# EAGLE design hermes-control (EAGLE 9.4.0)
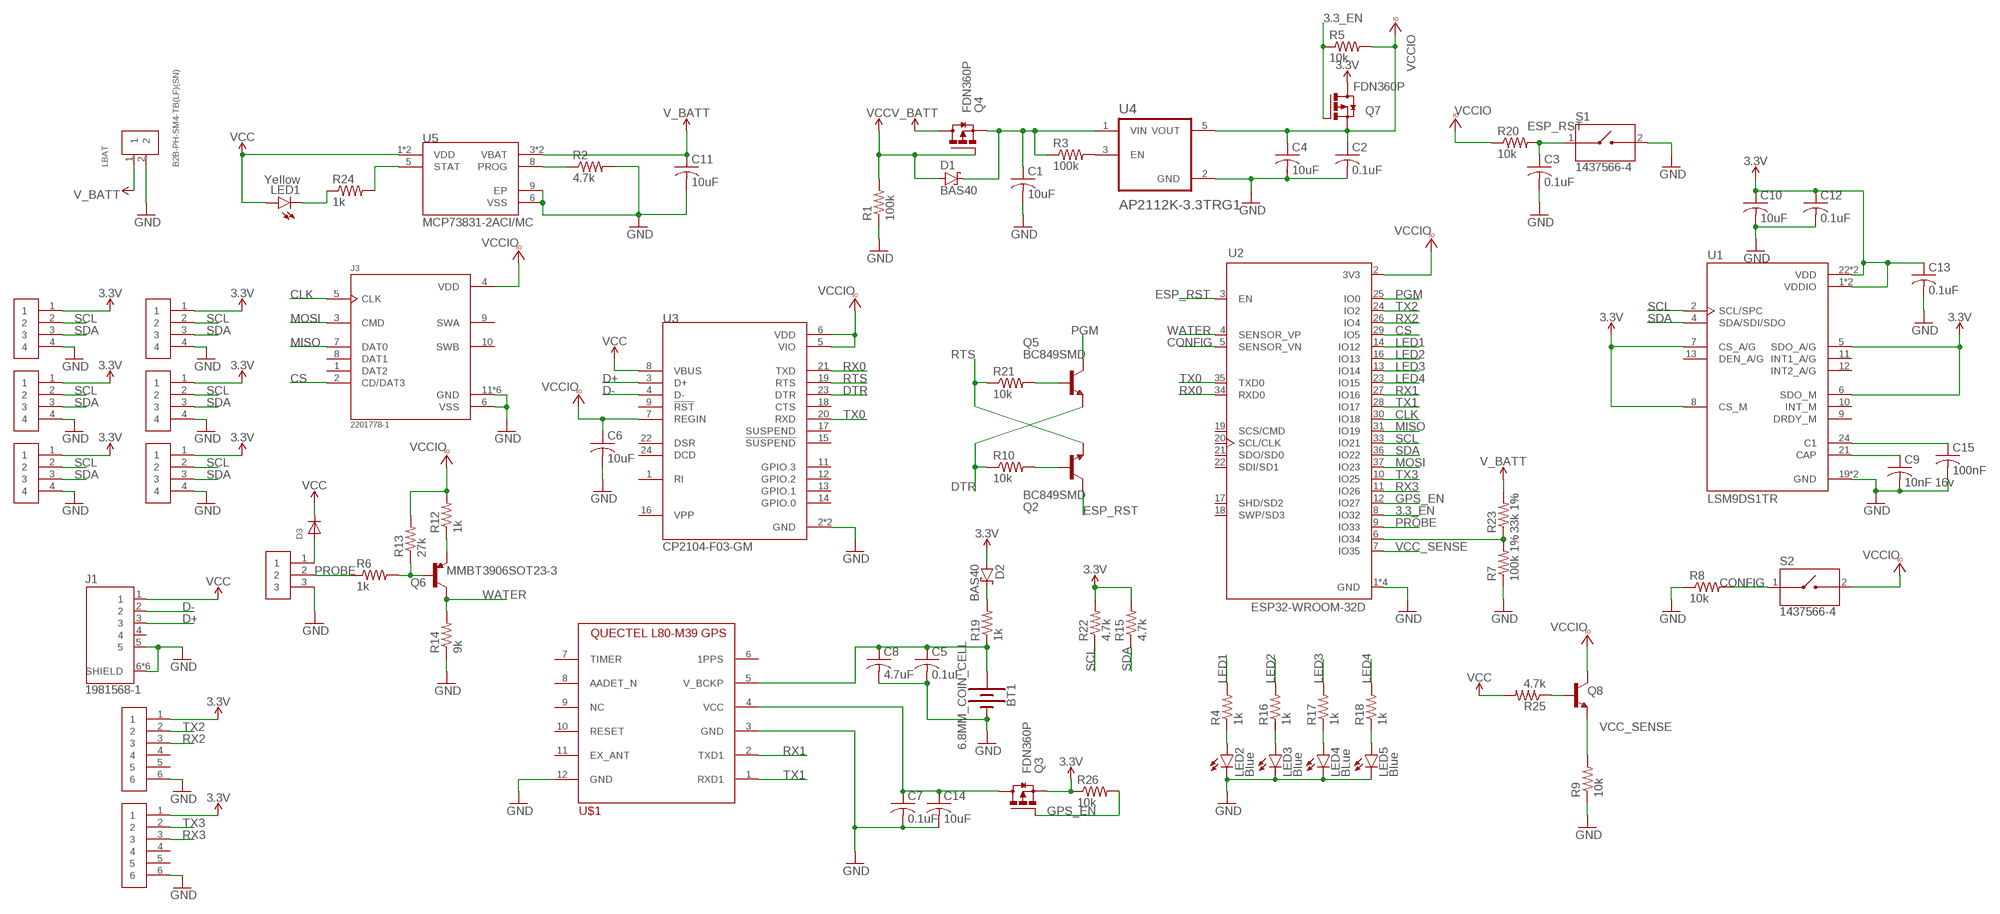
[diagram p0: schematic, sheet 1]

## Parts
BT1  6.8MM_COIN_CELL  BATTERY-6.8MM_SMD  [BATTCON-6.8MM]
C1  10uF  C-USC0603  [C0603]
C2  0.1uF  C-USC0603  [C0603]
C3  0.1uF  C-USC0603  [C0603]
C4  10uF  C-USC0603  [C0603]
C5  0.1uF  C-USC0603  [C0603]
C6  10uF  C-USC0603  [C0603]
C7  0.1uF  C-USC0603  [C0603]
C8  4.7uF  C-USC0603  [C0603]
C9  10nF 16v  C-USC0603  [C0603]
C10  10uF  C-USC0603  [C0603]
C11  10uF  C-USC0603  [C0603]
C12  0.1uF  C-USC0603  [C0603]
C13  0.1uF  C-USC0603  [C0603]
C14  10uF  C-USC0603  [C0603]
C15  100nF  C-USC0603  [C0603]
D1  BAS40  [SOT23]
D2  BAS40  [SOT23]
D3  DIODE_SOD-123FL  [SOD-123FL]
J1  1981568-1  [TE_1981568-1]
J3  2201778-1  [TE_2201778-1]
LBAT  B2B-PH-SM4-TB(LF)(SN)  [JST_B2B-PH-SM4-TB(LF)(SN)]
LED1  Yellow  LEDCHIPLED_0805  [CHIPLED_0805]
LED2  Blue  LEDCHIPLED_0805  [CHIPLED_0805]
LED3  Blue  LEDCHIPLED_0805  [CHIPLED_0805]
LED4  BLue  LEDCHIPLED_0805  [CHIPLED_0805]
LED5  Blue  LEDCHIPLED_0805  [CHIPLED_0805]
Q2  BC849SMD  [SOT23-BEC]
Q3  FDN360P  [SUPER-SOT3]
Q4  FDN360P  [SUPER-SOT3]
Q5  BC849SMD  [SOT23-BEC]
Q6  MMBT3906SOT23-3  [SOT23-3]
Q7  FDN360P  [SUPER-SOT3]
Q8  MMBT2222A  [SOT23]
R1  100k  R-US_R0603  [R0603]
R2  4.7k  R-US_R0603  [R0603]
R3  100k  R-US_R0603  [R0603]
R4  1k  R-US_R0603  [R0603]
R5  10k  R-US_R0603  [R0603]
R6  1k  R-US_R0603  [R0603]
R7  100k 1%  R-US_R0603  [R0603]
R8  10k  R-US_R0603  [R0603]
R9  10k  R-US_R0603  [R0603]
R10  10k  R-US_R0603  [R0603]
R12  1k  R-US_R0603  [R0603]
R13  27k  R-US_R0603  [R0603]
R14  9k  R-US_R0603  [R0603]
R15  4.7k  R-US_R0603  [R0603]
R16  1k  R-US_R0603  [R0603]
R17  1k  R-US_R0603  [R0603]
R18  1k  R-US_R0603  [R0603]
R19  1k  R-US_R0603  [R0603]
R20  10k  R-US_R0603  [R0603]
R21  10k  R-US_R0603  [R0603]
R22  4.7k  R-US_R0603  [R0603]
R23  33k 1%  R-US_R0603  [R0603]
R24  1k  R-US_R0603  [R0603]
R25  4.7k  R-US_R0603  [R0603]
R26  10k  R-US_R0603  [R0603]
S1  1437566-4  [SW_1437566-4]
S2  1437566-4  [SW_1437566-4]
U1  LSM9DS1TR  [PQFN43P300X350X102-24N]
U2  ESP32-WROOM-32D  [MODULE_ESP32-WROOM-32D]
U3  CP2104-F03-GM  [QFN50P400X400X80-25N]
U4  AP2112K-3.3TRG1  [SOT95P285X140-5N]
U5  MCP73831-2ACI/MC  [SON50P200X300X100-9N]
U$1  L80_GNSS_MODULE  [L80_PACKAGE]
U$2  JST-GH-3VERT  [JST-GH-TOP-3]
U$3  JST-GH-4TOP  [JST-GH-TOP-4]
U$4  JST-GH-4TOP  [JST-GH-TOP-4]
U$5  JST-GH-4TOP  [JST-GH-TOP-4]
U$7  JST-GH-6TOP-ENTRY  [JST-GH-TOP-6]
U$8  JST-GH-6TOP-ENTRY  [JST-GH-TOP-6]
U$9  JST-GH-4TOP  [JST-GH-TOP-4]
U$10  JST-GH-4TOP  [JST-GH-TOP-4]
U$11  JST-GH-4TOP  [JST-GH-TOP-4]

## Nets
3.3_EN: Q7.1(G) R5.1 U2.8(IO32)
3.3V: C10.1 C12.1 C13.1 D2.1(A) Q3.2(S) Q7.3(D) R15.2 R22.2 R26.1 U1.1(VDDIO) U1.3(VDDIO) U1.5(SDO_A/G) U1.6(SDO_M) U1.7(CS_A/G) U1.8(CS_M) U1.22(VDD) U1.23(VDD) U$3.1 U$4.1 U$5.1 U$7.1 U$8.1 U$9.1 U$10.1 U$11.1
CLK: J3.5(CLK) U2.30(IO18)
CONFIG: R8.2 S2.1 U2.5(SENSOR_VN)
CS: J3.2(CD/DAT3) U2.29(IO5)
D+: J1.3 U3.3(D+)
D-: J1.2 U3.4(D-)
DTR: Q5.E R10.1 U3.23(DTR)
ESP_RST: C3.1 Q2.C R20.2 S1.1 U2.3(EN)
GND: BT1.- C1.2 C2.2 C3.2 C4.2 C5.2 C6.2 C7.2 C8.2 C9.2 C10.2 C11.2 C12.2 C13.2 C14.2 C15.2 J1.5 J1.6(SHIELD) J1.7(SHIELD) J1.8(SHIELD) J1.9(SHIELD) J1.10(SHIELD) J1.11(SHIELD) J3.6(VSS) J3.11(GND) J3.12(GND) J3.13(GND) J3.14(GND) J3.15(GND) J3.16(GND) LBAT.2 LED2.C LED3.C LED4.C LED5.C R1.1 R2.2 R7.1 R8.1 R9.1 R14.1 S1.2 U1.19(GND) U1.20(GND) U2.1(GND) U2.15(GND) U2.38(GND) U2.39(GND) U3.2(GND) U3.25(GND) U4.2(GND) U5.6(VSS) U5.9(EP) U$1.3(GND) U$1.12(GND) U$2.3 U$3.4 U$4.4 U$5.4 U$7.6 U$8.6 U$9.4 U$10.4 U$11.4
GPS_EN: Q3.1(G) R26.2 U2.12(IO27)
IO13: R7.2 R23.1 U2.6(IO34)
LED1: R4.2 U2.14(IO12)
LED2: R16.2 U2.16(IO13)
LED3: R17.2 U2.13(IO14)
LED4: R18.2 U2.23(IO15)
MISO: J3.7(DAT0) U2.31(IO19)
MOSI: J3.3(CMD) U2.37(IO23)
N$1: R2.1 U5.8(PROG)
N$2: R24.2 U5.5(STAT)
N$3: LED1.C R24.1
N$4: C1.1 D1.3(C) Q4.2(S) R3.1 U4.1(VIN)
N$5: R3.2 U4.3(EN)
N$6: C7.1 C14.1 Q3.3(D) U$1.4(VCC)
N$7: D3.A U$2.1
N$9: C9.1 U1.21(CAP)
N$10: C15.1 U1.24(C1)
N$13: Q6.1(B) R6.2 R13.1
N$14: Q6.2(E) R12.1
N$15: BT1.+ C5.1 C8.1 R19.1 U$1.5(V_BCKP)
N$16: D2.3(C) R19.2
N$17: LED2.A R4.1
N$18: LED3.A R16.1
N$19: Q2.B R10.2
N$20: Q5.B R21.2
N$21: LED4.A R17.1
N$22: LED5.A R18.1
N$24: Q8.1(B) R25.1
PGM: Q5.C U2.25(IO0)
PROBE: R6.1 U2.9(IO33) U$2.2
RTS: Q2.E R21.1 U3.19(RTS)
RX0: U2.34(RXD0) U3.21(TXD)
RX1: U2.27(IO16) U$1.2(TXD1)
RX2: U2.26(IO4) U$7.3
RX3: U2.11(IO26) U$8.3
SCL: R22.1 U1.2(SCL/SPC) U2.33(IO21) U$3.2 U$4.2 U$5.2 U$9.2 U$10.2 U$11.2
SDA: R15.1 U1.4(SDA/SDI/SDO) U2.36(IO22) U$3.3 U$4.3 U$5.3 U$9.3 U$10.3 U$11.3
TX0: U2.35(TXD0) U3.20(RXD)
TX1: U2.28(IO17) U$1.1(RXD1)
TX2: U2.24(IO2) U$7.2
TX3: U2.10(IO25) U$8.2
V_BATT: C11.1 LBAT.1 Q4.3(D) R23.2 U5.3(VBAT) U5.4(VBAT)
VCC: D1.1(A) D3.C J1.1 LED1.A Q4.1(G) R1.2 R25.2 U3.8(VBUS) U5.1(VDD) U5.2(VDD)
VCC_SENSE: Q8.2(E) R9.2 U2.7(IO35)
VCCIO: C2.1 C4.1 C6.1 J3.4(VDD) Q7.2(S) Q8.3(C) R5.2 R12.2 R13.2 R20.1 S2.2 U2.2(3V3) U3.5(VIO) U3.6(VDD) U3.7(REGIN) U4.5(VOUT)
WATER: Q6.3(C) R14.2 U2.4(SENSOR_VP)
Unconnected: J1.4 J3.1(DAT2) J3.8(DAT1) J3.9(SWA) J3.10(SWB) U1.9(DRDY_M) U1.10(INT_M) U1.11(INT1_A/G) U1.12(INT2_A/G) U1.13(DEN_A/G) U2.17(SHD/SD2) U2.18(SWP/SD3) U2.19(SCS/CMD) U2.20(SCL/CLK) U2.21(SDO/SD0) U2.22(SDI/SD1) U3.1(RI) U3.9(!RST) U3.11(GPIO.3) U3.12(GPIO.2) U3.13(GPIO.1) U3.14(GPIO.0) U3.15(!SUSPEND) U3.16(VPP) U3.17(SUSPEND) U3.18(CTS) U3.22(DSR) U3.24(DCD) U$1.6(1PPS) U$1.7(TIMER) U$1.8(AADET_N) U$1.9(NC) U$1.10(RESET) U$1.11(EX_ANT) U$7.4 U$7.5 U$8.4 U$8.5

## Library data of the parts
BT1 = SparkFun-Batteries:BATTERY: Battery - Single Cell A variety of battery chemistries, sizes, and footprints. Device List: 20MM_PTH - Coin Cell Battery Holder - 20mm (PTH) <https://www.sparkfun.com/products/783> 6.8MM_PTH - Coin Cell Battery Holder - 6.8MM(SMD) <https://www.digikey.com/product-detail/en/seiko-instruments/MS621FE-FL11E/728-1057-ND/1889208?WT.srch=1&gclid=CNOQ5a6LzdQCFZS2wAodXCkE0g> 12MM_SMD - Coin Cell Battery Holder - 12mm (SMD) <https://www.sparkfun.com/products/10592> 12MM_PTH - Coin Cell Battery Holder - 12mm (PTH) <https://www.sparkfun.com/products/7948> 20MM_SMD - 20mm Coin Cell Battery Holder (SMD) (2 legs) Used on the Big Time Watch Kit <https://www.sparkfun.com/products/11734> 20MM_SMD_4LEGS - Coin Cell Battery Holder - 20mm (SMD) <https://www.sparkfun.com/products/11892> 20MM_SMD_4LEGS_OVERPASTE - Coin Cell Battery Holder - 20mm (SMD) <https://www.sparkfun.com/products/11892> (Over-paste on the legs) 24.5MM_PTH - Coin Cell Battery Holder - 24.5mm (PTH) <https://www.sparkfun.com/products/8863> 9V - 9V Battery Holder - PC Mount Used on the SparkFun SparkPunk Sound Kit <https://www.sparkfun.com/products/11177> and SparkFun SparkPunk Sequencer Kit <https://www.sparkfun.com/products/12707> 18650 - Battery Holder - 18650 (PTH) <https://www.sparkfun.com/products/13113> AA - Battery Holder - 1xAA (PTH) <https://www.sparkfun.com/products/7949> AAA - Battery Holder - 1xAAA (PTH) <https://www.sparkfun.com/products/12718> AA_KIT - Battery Holder - 1xAA (PTH) <https://www.sparkfun.com/products/7949> Special kit package - pads only have exposed copper on one side of the board. AAA_KIT - Battery Holder - 1xAAA (PTH) <https://www.sparkfun.com/products/12718> Special kit package - pads only have exposed copper on one side of the board.; PROD_ID: BATT-13734
C1-C15 = rcl:C-US: CAPACITOR, American symbol; SPICEPREFIX: C
D1 D2 = diode:BAS40: Silicon Schottky Diodes General-purpose diode for high-speed switching
D3 = adafruit:DIODE: Diode SMADIODE - SMA Surface Mount Package 20V 1A Schottky Diode Digikey: 641-1014-6-ND DO-1N4148 - Through Hole Small Current Diode SOD-123 20V 1 A (.5mV Vf) Schottky Diode - Digikey: MBRX120TPMSCT-ND SOD-323 10V 570mA (.38mV Vf, 3ns) Schottky Diode - Digikey: ZLLS410CT-ND SOD-523 30V 30mA Schottky Diode (RB751S-40TE61) - Digikey: RB751S-40TE61CT-ND SOT23-R/W - SOT23 Package (R = Solder Paste/Reflow Ovens, W = Hand-Soldering) BAT54Film 40V 300mA - Digikey: 497-7162-1-ND
J1 = SnapEDA-Library (1):1981568-1: CONN RCPT MICRO USB B R/A SMD; APPLICATION: POWER & SIGNAL; CONNECTOR: USB-MICRO B; CURRENT_RATING: 1.8; DESIGNATOR: 1981568-1; FINISH: GOLD; FOOTPRINT: SMT; GENDER: Receptacle; LATEST_REVISION_DATE: 13AUG15; LATEST_REVISION_NOTE: REVISED PER ECO-15-009877; MANUFACTURER: TE CONNECTIVITY; MANUFACTURER_LINK: http://www.te.com/commerce/DocumentDelivery/DDEController?Action=showdoc&DocId=Customer+Drawing%7F1981568%7FE2%7Fpdf%7FEnglish%7FENG_CD_1981568_E2.pdf%7F1981568-1; NO_OF_POSITION: 5; ORIENTATION: Right Angle; PACKAGE: USB 2.0; PART_DESCRIPTION: MICRO USB 2.0 PECEPTACLE CONNECTOR R/A TYPE B ASSEMBLY; PART_REV: E2; PITCH: 0.65mm; PUBISHER: TE CONNECTIVITY; PUBLISHED: 07AUG2007; ROHS_COMPLIANT: YES; SERIES: MICRO USB 2.0; STANDARD: MANUFACTURER RECOMMENDATIONS; TECHNOLOGY: Cable-to-Board; TE_PART_NUMBER: 1981568-1; TYPE: USB 2.0 RECEPTACLE
J3 = hermes:2201778-1: MICRO SD PUSH PUSH LOW PROFILE TYPE; MANUFACTURER: TE Connectivity; PARTREV: B; STANDARD: Manufacturer recommendations
LBAT = B2B-PH-SM4-TB_LF__SN_:B2B-PH-SM4-TB(LF)(SN): PH Series 2 Position 2 mm Pitch Surface Mount Top Entry Shrouded Header; AVAILABILITY: Unavailable; DESCRIPTION: PH Series 2 Position 2 mm Pitch Surface Mount Top Entry Shrouded Header; MF: JST Sales; MP: B2B-PH-SM4-TB_LF__SN_; PACKAGE: None; PRICE: None
LED1-LED5 = led:LED: LED OSRAM: - CHIPLED LG R971, LG N971, LY N971, LG Q971, LY Q971, LO R971, LY R971 LH N974, LH R974 LS Q976, LO Q976, LY Q976 LO Q996 - Hyper CHIPLED LW Q18S LB Q993, LB Q99A, LB R99A - SideLED LS A670, LO A670, LY A670, LG A670, LP A670 LB A673, LV A673, LT A673, LW A673 LH A674 LY A675 LS A676, LA A676, LO A676, LY A676, LW A676 LS A679, LY A679, LG A679 - Hyper Micro SIDELED® LS Y876, LA Y876, LO Y876, LY Y876 LT Y87S - SmartLED LW L88C, LW L88S LB L89C, LB L89S, LG L890 LS L89K, LO L89K, LY L89K LS L896, LA L896, LO L896, LY L896 - TOPLED LS T670, LO T670, LY T670, LG T670, LP T670 LSG T670, LSP T670, LSY T670, LOP T670, LYG T670 LG T671, LOG T671, LSG T671 LB T673, LV T673, LT T673, LW T673 LH T674 LS T676, LA T676, LO T676, LY T676, LB T676, LH T676, LSB T676, LW T676 LB T67C, LV T67C, LT T67C, LS T67K, LO T67K, LY T67K, LW E67C LS E67B, LA E67B, LO E67B, LY E67B, LB E67C, LV E67C, LT E67C LW T67C LS T679, LY T679, LG T679 LS T770, LO T770, LY T770, LG T770, LP T770 LB T773, LV T773, LT T773, LW T773 LH T774 LS E675, LA E675, LY E675, LS T675 LS T776, LA T776, LO T776, LY T776, LB T776 LHGB T686 LT T68C, LB T68C - Hyper Mini TOPLED® LB M676 - Mini TOPLED Santana® LG M470 LS M47K, LO M47K, LY M47K Source: http://www.osram.convergy.de LUXEON: - LUMILED® LXK2-PW12-R00, LXK2-PW12-S00, LXK2-PW14-U00, LXK2-PW14-V00 LXK2-PM12-R00, LXK2-PM12-S00, LXK2-PM14-U00 LXK2-PE12-Q00, LXK2-PE12-R00, LXK2-PE12-S00, LXK2-PE14-T00, LXK2-PE14-U00 LXK2-PB12-K00, LXK2-PB12-L00, LXK2-PB12-M00, LXK2-PB14-N00, LXK2-PB14-P00, LXK2-PB14-Q00 LXK2-PR12-L00, LXK2-PR12-M00, LXK2-PR14-Q00, LXK2-PR14-R00 LXK2-PD12-Q00, LXK2-PD12-R00, LXK2-PD12-S00 LXK2-PH12-R00, LXK2-PH12-S00 LXK2-PL12-P00, LXK2-PL12-Q00, LXK2-PL12-R00 Source: www.luxeon.com KINGBRIGHT: KA-3528ASYC Source: www.kingbright.com
Q2 Q5 = transistor-npn:BC849*: NPN Transistor
Q3 Q4 Q7 = transistor-power:FDN360P: Single P-Channel, PowerTrench (R) MOSFET Source: http://www.fairchildsemi.com/ds/FD/FDN360P.pdf
Q6 = MMBT3906:MMBT3906: 2N3906 General Purpose PNP Transistor PNP General Purpose Amplifier 2N3906/ MMBT3906 / PZT3906 (TO-92 / SOT23 / SOT23-3) This device is designed for general purpose amplifier and switching applications at collector currents of 10 mA to 100 mA; AVAILABILITY: Unavailable; DESCRIPTION: MMBT3906 Series 40 V 0.2 A 350 mW PNP General Purpose Amplifier - SOT-23; MF: STMicroelectronics; MP: MMBT3906; PACKAGE: SOT-23 ON Semiconductor; PRICE: None
Q8 = hermes:MMBT2222A: 2N2222 General Purpose NPN Transistor; DIGIKEY: 568-4509-6-ND; ELEMENT14: 1757934
R1-R10 R12-R26 = rcl:R-US_: RESISTOR, American symbol; SPICEPREFIX: R
S1 S2 = 1437566-4:1437566-4: SWITCH TACTILE SPST-NO 0.05A 24V; AVAILABILITY: Unavailable; COMMENT: 1437566-4; CONFIGURATION_POLE-THROW: Single Pole - Single Throw; CONTACT_CURRENT_RATING: 50 mA; DESCRIPTION: FSMSMTR=TACT SWITCH; MF: TE Connectivity; MP: FSMSMTR; PACKAGE: None; PRICE: None; TE_PURCHASE_URL: https://www.te.com/usa-en/product-1437566-4.html?te_bu=Cor&te_type=disp&te_campaign=seda_glo_cor-seda-global-disp-prtnr-fy19-seda-model-bom-cta_sma-317_1&elqCampaignId=32493
U1 = hermes-parts:LSM9DS1TR: The LSM9DS1 is a system-in-package featuring a 3D digital linear acceleration sensor, a 3D digital angular rate sensor, and a 3D digital magnetic sensor.; MANUFACTURER: ST MICROELECTRONICS; PACKAGE: LGA-24; PARTREV: 3; STANDARD: IPC 7351B
U2 = SnapEDA-Library:ESP32-WROOM-32D: IC: SoC; GPIO, I2C, I2S, IR, SD, SDIO, SPI, UART; 2.7÷3.6VDC; 20dBm; MANUFACTURER: Espressif Systems; PARTREV: 1.5; STANDARD: Manufacturer Recommendation
U3 = SnapEDA-Library:CP2104-F03-GM: USB-to-UART 1-CH 576byte FIFO 3.3V 24-Pin QFN EP T/R; MANUFACTURER: Silicon Labs; PARTREV: 1.2; STANDARD: IPC7351B
U4 = SnapEDA-Library:AP2112K-3.3TRG1: AP2112 Series 0.6 A 3.3 V Fixed Output SMT LDO Linear Regulator - SOT23-5; MANUFACTURER: Diodes Inc.; PARTREV: 2-2
U5 = SnapEDA-Library:MCP73831-2ACI/MC: MCP73831 Series Single-Cell Li-Ion/Li-Polymer Battery Charge Controller - DFN-8; MANUFACTURER: MICROCHIP; PARTREV: G; STANDARD: IPC 7351B
U$1 = Quectel:L80_GNSS_MODULE: GPS module with an embedded patch antenna (15mmx15mmx4mm)
U$2 = BlueRobotics-JST-GH:JST-GH-3
U$3-U$5 U$9-U$11 = BlueRobotics-JST-GH:JST-GH-4
U$7 U$8 = BlueRobotics-JST-GH:JST-GH-6

## Board
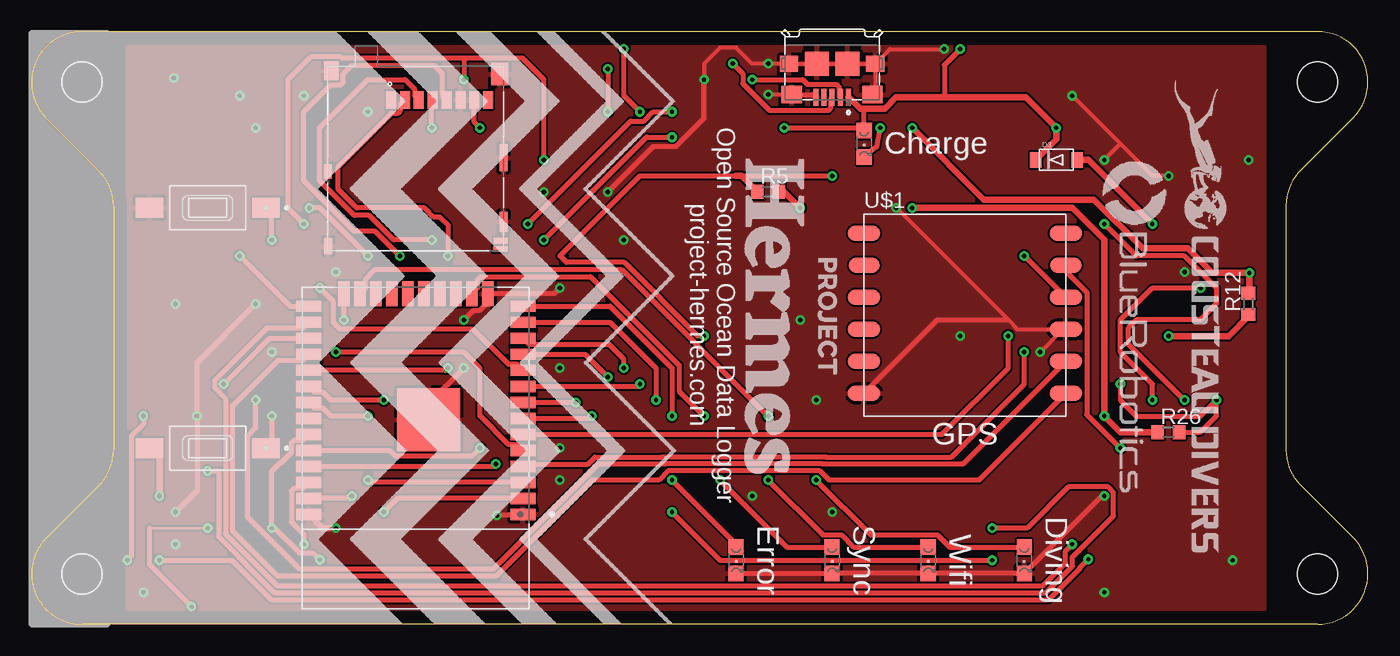
[diagram p1: board, top side]
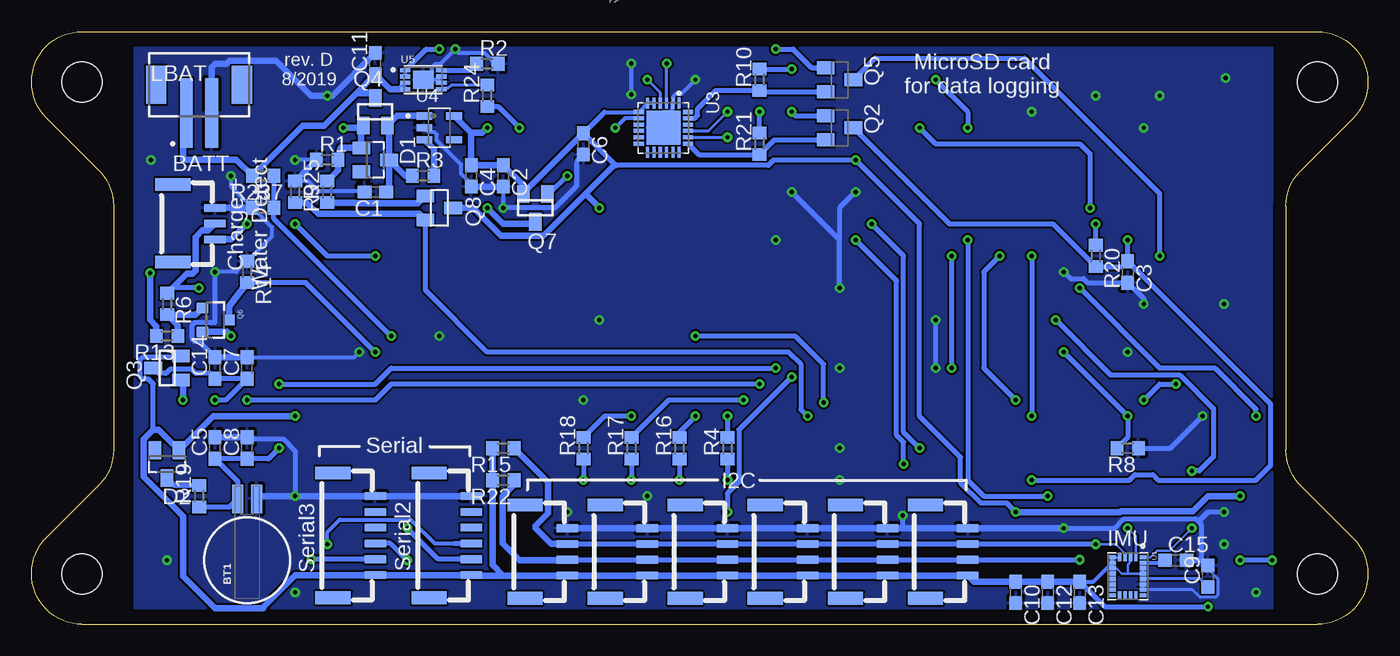
[diagram p2: board, bottom side, seen from below]

Size 106 x 47 mm. Coordinates in mm from the lower left corner, seen from the top.
Outline: 1.2,40.1 5.4,35.9 arc-45 6.5,33.19 6.5,13.8 arc-45 5.33,10.99 1.17,6.83 arc135 4,0 102,0 arc135 104.8,6.9 100.6,11.1 arc-45 99.5,13.81 99.5,33.2 arc-45 100.67,36.02 104.83,40.17 arc135 102,47 4,47 arc135 1.2,40.1
Copper layers (1*16): Top 0.035mm / dielectric 1.5mm / Bottom 0.035mm
Design rules "default *": minimum track width 6mil, minimum drill 0.35mm, track to track 6mil, track to pad 6mil, pad to pad 6mil, via to via 6mil, smd to smd 6mil, copper to edge 40mil, drill to drill 6mil, minimum pad ring 10mil, minimum via ring 8mil, stop-mask expansion 4mil, vias tented up to drill 30mil, thermal gap 10mil
Holes 3.2 mm at 4,4 4,43 102,43 102,4

### Footprints (pad centres in the part's own frame; a part is rotated, then mirrored left to right if it is on the bottom)
BATTCON-6.8MM = smd 2.25 x 0.85: + 4.87,0.75; - 4.87,-0.75
C0603 = smd 1.1 x 1: 1 -0.85,0; 2 0.85,0
SOT23 = smd 1 x 1.4: 1 -0.95,-1.1; 2 0.95,-1.1; 3 0,1.1
SOD-123FL = smd 0.91 x 1.22: A 1.637,0; C -1.637,0
TE_1981568-1 = smd 0.4 x 1.35: 1 -1.3,2.675; 2 -0.65,2.675; 3 0,2.675; 4 0.65,2.675; 5 1.3,2.675 | smd 1.6 x 1.4: 6 -3.2,2.45; 7 3.2,2.45 | smd 1.45 x 1.3: 8 3.425,0; 9 -3.425,0 | smd 1.9 x 1.9: 10 -1.2,0; 11 1.2,0
TE_2201778-1 = smd 0.8 x 1.4: 1 1.965,-4.75; 2 0.865,-4.75; 3 -0.235,-4.75; 4 -1.335,-4.75; 5 -2.435,-4.75; 6 -3.535,-4.75; 7 -4.635,-4.75; 8 -5.735,-4.75 | smd 1.15 x 0.45: 9 -6.7,7.075 | smd 1.1 x 0.45: 10 -6.725,6.415 | smd 1.35 x 1.8: 11 -6.625,-6.8 | smd 0.65 x 2.14: 12 -6.95,-0.17 | smd 0.65 x 1.6: 13 -6.95,4.91 | smd 0.65 x 1.3: 14 6.95,6.85 | smd 0.6 x 1.15: 15 6.975,0.925 | smd 1.16 x 1.5: 16 6.695,-7.05
JST_B2B-PH-SM4-TB(LF)(SN) = smd 1 x 5.5: 1 -1,0; 2 1,0 | smd 1.6 x 3: 3 -3.4,2.25; 4 3.4,2.25
CHIPLED_0805 = smd 1.2 x 1.2: A 0,-1.05; C 0,1.05
SOT23-BEC = smd 1 x 1.4: B -0.95,-1.1; C 0,1.1; E 0.95,-1.1
SUPER-SOT3 = smd 1 x 1.4: 1 -0.95,-1.1; 2 0.95,-1.1; 3 0,1.1
SOT23-3 = smd 0.8 x 0.9: 1 -0.95,-1; 2 0.95,-1; 3 0,1.1
R0603 = smd 1 x 1.1: 1 -0.85,0; 2 0.85,0
SW_1437566-4 = smd 2.18 x 1.6: 1 -4.6,0; 2 4.6,0
PQFN43P300X350X102-24N = smd 0.28 x 0.53: 1 -1.505,1.22; 6 -1.505,-1.22; 7 -1.075,-1.22; 8 -0.645,-1.22; 9 -0.215,-1.22; 10 0.215,-1.22; 11 0.645,-1.22; 12 1.075,-1.22; 13 1.505,-1.22; 18 1.505,1.22; 19 1.075,1.22; 20 0.645,1.22; 21 0.215,1.22; 22 -0.215,1.22; 23 -0.645,1.22; 24 -1.075,1.22 | smd 0.53 x 0.28: 2 -1.47,0.645; 3 -1.47,0.215; 4 -1.47,-0.215; 5 -1.47,-0.645; 14 1.47,-0.645; 15 1.47,-0.215; 16 1.47,0.215; 17 1.47,0.645
MODULE_ESP32-WROOM-32D = smd 2 x 0.9: 1 -8.5,5.26; 2 -8.5,3.99; 3 -8.5,2.72; 4 -8.5,1.45; 5 -8.5,0.18; 6 -8.5,-1.09; 7 -8.5,-2.36; 8 -8.5,-3.63; 9 -8.5,-4.9; 10 -8.5,-6.17; 11 -8.5,-7.44; 12 -8.5,-8.71; 13 -8.5,-9.98; 14 -8.5,-11.25; 25 8.5,-11.25; 26 8.5,-9.98; 27 8.5,-8.71; 28 8.5,-7.44; 29 8.5,-6.17; 30 8.5,-4.9; 31 8.5,-3.63; 32 8.5,-2.36; 33 8.5,-1.09; 34 8.5,0.18; 35 8.5,1.45; 36 8.5,2.72; 37 8.5,3.99; 38 8.5,5.26 | smd 0.9 x 2: 15 -5.715,-12.25; 16 -4.445,-12.25; 17 -3.175,-12.25; 18 -1.905,-12.25; 19 -0.635,-12.25; 20 0.635,-12.25; 21 1.905,-12.25; 22 3.175,-12.25; 23 4.445,-12.25; 24 5.715,-12.25 | smd 5 x 5: 39 -1,-2.24
QFN50P400X400X80-25N = smd 0.84 x 0.26: 1 -1.97,1.25 | smd 0.82 x 0.26: 2 -1.955,0.75; 3 -1.955,0.25; 4 -1.955,-0.25; 5 -1.955,-0.75; 6 -1.955,-1.25; 13 1.955,-1.25; 14 1.955,-0.75; 15 1.955,-0.25; 16 1.955,0.25; 17 1.955,0.75; 18 1.955,1.25 | smd 0.26 x 0.82: 7 -1.25,-1.955; 8 -0.75,-1.955; 9 -0.25,-1.955; 10 0.25,-1.955; 11 0.75,-1.955; 12 1.25,-1.955; 19 1.25,1.955; 20 0.75,1.955; 21 0.25,1.955; 22 -0.25,1.955; 23 -0.75,1.955; 24 -1.25,1.955 | smd 2.7 x 2.7: 25 0,0
SOT95P285X140-5N = smd 1.35 x 0.6: 1 -1.185,0.95; 2 -1.185,0; 3 -1.185,-0.95; 4 1.185,-0.95; 5 1.185,0.95
SON50P200X300X100-9N = smd 0.84 x 0.27: 1 -1.435,0.75; 2 -1.435,0.25; 3 -1.435,-0.25; 4 -1.435,-0.75; 5 1.435,-0.75; 6 1.435,-0.25; 7 1.435,0.25; 8 1.435,0.75 | smd 1.625 x 1.425: 9 0,0
L80_PACKAGE = smd 2.6 x 1.25: 1 16,1.8; 2 16,4.34; 3 16,6.88; 4 16,9.42; 6 16,14.5; 7 0,14.5; 9 0,9.42; 10 0,6.88; 11 0,4.34; 12 0,1.8 | smd 2.5 x 1.25: 5 16,11.96; 8 0,11.96
JST-GH-TOP-3 = smd 0.6 x 1.7: 1 2.5,0; 2 1.25,0; 3 0,0 | smd 1 x 2.8: MECH1 4.3,-3.35; MECH2 -1.85,-3.35
JST-GH-TOP-4 = smd 0.6 x 1.7: 1 3.75,0; 2 2.5,0; 3 1.25,0; 4 0,0 | smd 1 x 2.8: MECH1 5.55,-3.35; MECH2 -1.85,-3.35
JST-GH-TOP-6 = smd 0.6 x 1.7: 1 6.25,0; 2 5,0; 3 3.75,0; 4 2.5,0; 5 1.25,0; 6 0,0 | smd 1 x 2.8: MECH1 8.05,-3.35; MECH2 -1.85,-3.35

### Placement (x,y rotation side)
BT1  88.9,5.08 90 bottom
C1  78.74,34.29 180 bottom
C2  68.58,35.56 270 bottom
C3  19.05,27.94 270 bottom
C4  71.12,35.56 270 bottom
C5  91.44,13.97 90 bottom
C6  62.23,38.1 270 bottom
C7  88.9,20.32 90 bottom
C8  88.9,13.97 90 bottom
C9  12.7,3.81 90 bottom
C10  27.94,2.54 270 bottom
C11  78.74,44.45 90 bottom
C12  25.4,2.54 270 bottom
C13  22.86,2.54 270 bottom
C14  91.44,20.32 90 bottom
C15  15.24,5.08 0 bottom
D1  78.74,36.83 270 bottom
D2  95.25,12.7 180 bottom
D3  81.28,36.83 0 top
J1  63.5,44.45 180 top
J3  30.48,36.83 180 top
LBAT  92.71,40.53 0 bottom
LED1  66.04,38.1 180 top
LED2  55.88,5.08 180 top
LED3  63.5,5.08 180 top
LED4  71.12,5.08 180 top
LED5  78.74,5.08 180 top
Q2  41.91,39.37 270 bottom
Q3  95.25,20.32 90 bottom
Q4  78.74,40.64 0 bottom
Q5  41.91,43.18 270 bottom
Q6  91.44,24.13 270 bottom
Q7  66.04,33.02 180 bottom
Q8  73.66,33.02 270 bottom
R1  82.55,36.83 0 bottom
R2  69.85,44.45 0 bottom
R3  74.93,35.56 0 bottom
R4  50.8,13.97 90 bottom
R5  58.42,34.29 0 top
R6  95.25,25.4 270 bottom
R7  87.63,33.02 0 bottom
R8  19.05,13.97 180 bottom
R9  85.09,34.29 270 bottom
R10  48.26,43.18 90 bottom
R12  96.52,25.4 90 top
R13  95.25,22.86 180 bottom
R14  88.9,27.94 270 bottom
R15  68.58,13.97 180 bottom
R16  54.61,13.97 90 bottom
R17  58.42,13.97 90 bottom
R18  62.23,13.97 90 bottom
R19  92.71,10.16 90 bottom
R20  21.59,29.21 270 bottom
R21  48.26,38.1 90 bottom
R22  68.58,11.43 180 bottom
R23  87.63,35.56 180 bottom
R24  69.85,41.91 90 bottom
R25  82.55,34.29 90 bottom
R26  90.17,15.24 0 top
S1  13.97,33.02 180 top
S2  13.97,13.97 180 top
U1  19.05,3.81 270 bottom
U2  30.48,13.97 180 top
U3  55.88,39.37 270 bottom
U4  73.66,39.37 0 bottom
U5  74.93,43.18 0 bottom
U$1  66.04,16.51 0 top
U$2  91.44,33.02 270 bottom
U$3  57.15,7.62 270 bottom
U$4  50.8,7.62 270 bottom
U$5  31.75,7.62 270 bottom
U$6  [REMORA-SILKSCREEN-CHEVRON]  5.43,46.99 270 top
U$7  71.12,10.16 270 bottom
U$8  78.74,10.16 270 bottom
U$9  44.45,7.62 270 bottom
U$10  38.1,7.62 270 bottom
U$11  63.5,7.62 270 bottom
U$12  [BR-FULL-LOGO-MEDIUM]  83.57,38.73 270 top
U$13  [COUSTEAU-DIVERS-LOGO-MEDIUM]  93.09,24.51 270 top
U$14  [HERMES-LOGO]  61.28,24.89 270 top

### Tracks (layer width: path | path; a pad name or v marks a point on that pad's centre or on a via)
3.3_EN  (via drill 0.35)
  Top 0.406: U2.8 v43.18,17.6 | v53.34,22.86 52.86,22.86 47.03,28.69 42.43,28.69 41.91,29.21 48.26,35.56 55.88,35.56 v63.5,35.56
  Top 0.508: R5.1 56.3,35.56 55.88,35.56
  Bottom 0.406: v43.18,17.6 43.18,20.62 45.42,22.86 v53.34,22.86 | v63.5,35.56 64.94,34.12 Q7.1
3.3V  (via drill 0.35)
  Top 0.203: v13.97,7.62 9.37,7.62
  Top 0.406: v12.7,1.4 9.37,4.72 9.37,7.62
  Top 0.508: v69.85,33.02 72,33.02 74,33.02 82.55,33.02 85.09,30.48 v85.09,16.51 86.36,15.24 R26.1
  Bottom 0.203: U1.8 20.23,4.42 19.91,4.42 19.51,4.02 19.05,4.02 | 19.05,4.02 U1.22 U1.23 | U1.6 20.24,5.28 U1.5 | U1.3 18.87,5.24 18.87,4.92 19.05,4.74 19.05,4.02 | v13.97,7.62 15.76,5.83 16.75,5.83 17.26,5.31 U1.1
  Bottom 0.305: C13.1 21.77,3.39 U1.7 | U1.8 U1.7 | U1.7 U1.6
  Bottom 0.406: C13.1 20.87,1.4 v12.7,1.4 | 96.35,15.42 96.35,19.07 96.74,19.46 97.2,19.46 97.41,19.67 97.41,20.97 97.2,21.17 94.24,21.17 Q3.2
  Bottom 0.508: 68.58,3.87 71.08,3.87 U$7.1 U$8.1 85.09,3.91 87.63,1.37 87.63,1.27 91.44,1.27 93.98,3.81 93.98,8.55 97.11,11.68 97.11,14.67 96.35,15.42 95.93,15.42 D2.1 91.59,16.51 v85.09,16.51 | 68.58,3.87 U$11.1 U$3.1 U$4.1 U$9.1 U$10.1 U$5.1 31.27,3.39 C10.1 C12.1 C13.1 | v69.85,33.02 68.58,31.75 66.4,31.75 66.39,31.74 66.22,31.74 Q7.3 | R15.2 R22.2 69.43,4.72 68.58,3.87
CLK  (via drill 0.35)
  Top 0.406: U2.30 22.44,18.4 23.13,18.4 23.75,17.78 v27.94,17.78 | v29.21,29.21 27.26,31.16 25.6,31.16 21.59,35.17 21.59,40.64 23.72,42.77 24.51,42.77 24.72,42.98 24.72,43.65 25.4,44.33 31.94,44.33 32.57,43.7 32.57,41.92 J3.5
  Bottom 0.406: v29.21,29.21 30.48,27.94 30.48,20.32 v27.94,17.78
CONFIG  (via drill 0.35)
  Top 0.406: U2.5 38.52,14.25 37.83,14.25 35.56,16.53 35.56,20.32 34.29,21.59 v24.13,21.59 | v19.05,16.51 19.05,14.45 S2.1
  Bottom 0.406: v24.13,21.59 v19.05,16.51 19.05,14.82 R8.2
CS  (via drill 0.35)
  Top 0.406: v33.02,29.21 33.02,31.67 32.4,32.29 31.9,32.29 31.17,33.02 25.8,33.02 24.33,34.49 24.33,36.3 28.56,40.52 29.06,40.52 29.27,40.73 29.27,41.23 J3.2 | v33.02,20.32 32.84,20.14 U2.29
  Bottom 0.406: v33.02,29.21 v33.02,20.32
D+  (via drill 0.35)
  Top 0.406: v55.63,44.45 56.42,43.66 56.42,42.88 58.55,40.74 63.2,40.74 63.41,40.95 63.41,41.68 J1.3
  Bottom 0.254: U3.3 v55.63,44.45
D-  (via drill 0.35)
  Top 0.406: v57.15,43.18 61.17,43.18 61.54,42.8 63.85,42.8 64.06,42.59 64.06,41.87 J1.2
  Bottom 0.254: U3.4 56.13,42.16 v57.15,43.18
DTR
  Bottom 0.406: Q5.E 48.16,42.23 R10.1 51.72,42.33 53.16,40.89 53.16,40.35 53.37,40.13 53.91,40.13 U3.23
ESP_RST  (via drill 0.35)
  Top 0.406: v19.05,30.48 19.05,32.54 S1.1 | U2.3 26.85,11.25 v26.67,11.43
  Bottom 0.406: C3.1 19.48,28.36 R20.2 24.98,31.75 33.19,31.75 Q2.C | C3.1 v19.05,30.48 | v26.67,11.43 18.91,11.43 18.48,11.87 17.08,11.87 16.65,11.43 8.89,11.43 7.72,12.6 7.72,17.46 C3.1
GND  (via drill 0.35)
  Top 0.305: v53.34,43.18 53.34,44.45 54.61,45.72 55.88,45.72 57.15,44.45 v58.42,44.45 J1.8 J1.11 J1.10 J1.9 | J1.7 v58.42,42 | J1.9 66.93,42.22 J1.6 | J1.9 68.08,45.61 v72.39,45.61 | v85.09,36.83 86.36,38.1 | v90.17,35.56 88.9,35.56 86.36,38.1 | 86.36,38.1 v82.55,41.91 | v68.58,33.02 77.47,24.13 78.21,23.39 U$1.3 81.81,23.39 v80.01,21.59
  Top 0.406: LED2.C LED3.C LED4.C LED5.C 84.87,10.16 v85.09,10.16 | U$1.12 71.86,24.13 77.47,24.13 | v34.29,24.13 35.02,24.86 35.52,24.86 36.2,25.54 U2.15 41.46,26.22 v41.91,26.67 | v34.29,20.32 31.48,17.51 U2.39 | U2.1 38.9,8.63 v36.91,8.63 | v17.78,25.4 13.12,20.74 v13.12,16.51 13.12,10.58 v11.43,8.89 | J1.7 61.98,42 J1.5 | v45.72,34.29 49.32,37.89 51.1,37.89 53.34,40.12 v53.34,43.18
  Top 0.508: v24.13,7.62 23.07,7.62 U2.38
  Bottom 0.254: U1.20 U1.19 13.92,2.73 13.32,2.13 12.08,2.13 11.92,2.29 11.92,3.62 12.7,4.4 C9.2
  Bottom 0.305: R9.1 84.03,35.14 83.23,34.33 79.64,34.33 C1.2 | v91.44,27.94 89.75,27.94 R14.1 86.95,30.74 86.95,31.49 R7.1 90.17,34.71 v90.17,35.56 | U3.25 55.88,40.57 55.85,40.61 55.38,40.61 55.2,40.79 55.2,41.26 U3.2 55.13,41.82 54.88,42.06 54.46,42.06 v53.34,43.18 | v58.42,42 v58.42,44.45 | R2.2 69.22,44.45 70.07,45.3 72.09,45.3 v72.39,45.61 73.56,44.44 73.97,44.44 74.22,44.19 74.22,43.78 74.82,43.18 U5.9 73.75,43.18 U5.6 | R1.1 v85.09,36.83 | U4.2 74.5,39.02 74.07,39.02 73.87,38.82 73.87,38.39 71.93,36.45 71.93,35.73 71.12,34.93 C4.2 | C2.2 v68.58,33.02 | C7.2 80.43,21.17 v80.01,21.59
  Bottom 0.406: C14.2 92.69,22.42 93.04,22.42 93.25,22.63 93.25,23.73 93.04,23.93 91.44,23.93 v91.44,27.94 | C8.2 88.78,14.7 86.06,14.7 85.09,13.74 v85.09,10.16 | v17.78,25.4 17.78,25.82 C3.2 22.24,27.09 22.56,27.4 23.59,27.4 v24.13,27.94 | v34.29,24.13 v34.29,20.32 | v36.91,8.63 36.91,7.7 36.83,7.62 | R8.1 15.66,13.97 v13.12,16.51 | v40.64,34.29 41.91,33.02 41.91,30.48 | v41.91,26.67 41.91,30.48 | C6.2 62.77,36.71 62.77,34.74 64.49,33.02 v68.58,33.02 | v24.13,7.62 20.09,7.62 19.35,8.35 13.67,8.35 13.24,7.92 13.24,5.19 C9.2 | v11.43,8.89 12.7,8.89 13.45,8.14 | 41.91,30.48 v45.72,34.29
  Bottom 0.508: U$11.4 U$3.4 U$4.4 U$9.4 U$10.4 36.83,7.62 U$5.4 v24.13,7.62 | U$7.6 U$8.6 v85.09,10.16 87.94,10.16 BT1.- | C5.2 C8.2 | C14.2 C7.2 | U$2.3 R7.1 | R9.1 R1.1 | C2.2 C4.2 | C15.2 13.12,5.08 C9.2 | C11.2 82.13,41.91 v82.55,41.91 83.82,41.91 86.6,44.69 90.28,44.69 90.52,44.45 91.44,44.45 91.71,44.18 LBAT.2
  other vias: 17.78,39.37 11.3,43.31 16.51,41.91 11.43,25.4 21.59,41.91 95.25,5.08 96.52,36.83 60.96,24.13 73.66,22.86 62.23,17.78 46.99,30.48 8.89,2.54 11.43,6.35 41.91,13.97 41.91,20.32 41.91,11.43 57.15,10.16 63.5,8.89 19.05,21.59 85.09,2.54 26.67,40.64
  pour Top (isolate 0.003): 7.62,45.72 7.62,1.27 97.79,1.27 97.79,45.72
  pour Bottom: 7.62,45.72 7.62,1.27 97.79,1.27 97.79,45.72
GPS_EN  (via drill 0.35)
  Top 0.406: U2.12 39.44,22.21 45.79,22.21 46.99,21.02 v46.99,20.32 | v86.36,19.05 86.36,17.78 87.63,16.51 92.71,16.51 v93.98,17.78 93.98,16.51 92.71,15.24 R26.2
  Bottom 0.406: v86.36,19.05 78.74,19.05 77.47,20.32 v46.99,20.32
  Bottom 0.508: v93.98,17.78 93.98,19.2 Q3.1
IO13  (via drill 0.35)
  Top 0.406: U2.6 72.21,15.06 77.47,20.32 v77.47,22.86
  Bottom 0.406: R23.1 R7.2 86.78,32.17 v77.47,22.86
LED1  (via drill 0.35)
  Top 0.406: U2.14 45.9,25.22 50.8,20.32 v50.8,16.51
  Bottom 0.406: v50.8,16.51 R4.2
LED2  (via drill 0.35)
  Top 0.406: v53.34,16.51 51.36,18.49 51.36,20.55 44.34,27.57 35.6,27.57 35.39,27.37 35.39,26.68 U2.16
  Bottom 0.406: v53.34,16.51 54.61,15.24 R16.2
LED3  (via drill 0.35)
  Top 0.406: U2.13 45.9,23.95 49.53,20.32 v49.53,17.78
  Bottom 0.406: v49.53,17.78 55.46,17.78 R17.2
LED4  (via drill 0.35)
  Top 0.406: U2.23 26.5,26.68 26.5,27.37 27.27,28.13 46.8,28.13 v58.42,16.51
  Bottom 0.406: v58.42,16.51 60.54,16.51 R18.2
MISO  (via drill 0.35)
  Top 0.406: v26.67,29.21 22.86,33.02 v22.04,33.02 | U2.31 22.44,17.13 23.13,17.13 23.75,16.51 v26.67,16.51 | v35.56,39.37 35.12,39.81 J3.7
  Bottom 0.406: v26.67,29.21 v26.67,16.51 | v22.04,33.02 22.04,37.27 22.86,38.1 34.29,38.1 v35.56,39.37
MOSI  (via drill 0.35)
  Top 0.406: v25.4,10.16 25.22,9.98 U2.37 | v31.75,30.48 28.73,30.48 26.78,32.43 25.6,32.43 22.85,35.18 22.85,39.36 26.67,43.18 29.62,43.18 30.37,42.43 30.37,41.92 J3.3
  Bottom 0.406: v31.75,30.48 31.75,11.43 30.48,10.16 v25.4,10.16
N$1
  Bottom 0.406: U5.8 71.22,43.93 R2.1
N$2
  Bottom 0.254: U5.5 73.43,42.5 72.98,42.5 72.72,42.76 R24.2
N$3  (via drill 0.35)
  Top 0.406: v67.31,39.37 67.02,37.86 LED1.C
  Bottom 0.406: R24.1 69,41.06 v67.31,39.37
N$4
  Bottom 0.508: U4.1 77.01,40.32 Q4.2 77.64,39.39 D1.3 | D1.3 76.37,35.56 R3.1 | C1.1 77.64,34.54 D1.3
N$5
  Bottom 0.508: R3.2 74.08,37.65 U4.3
N$6  (via drill 0.35)
  Top 0.406: v91.44,17.78 87,22.22 87,23.49 87.63,24.13 92.71,24.13 93.98,25.4 93.98,26.67 91.44,29.21 87.63,29.21 v85.09,31.75 | U$1.4 78.76,29.21 v78.74,29.21
  Bottom 0.406: v91.44,17.78 90.59,17.78 C7.1 C14.1 91.87,19.89 92.97,19.89 93.3,20.22 95,20.22 95.33,19.89 95.93,19.89 Q3.3 | v85.09,31.75 82.55,29.21 v78.74,29.21
N$7  (via drill 0.35)
  Top 0.508: v88.9,31.75 83.82,36.83 D3.A
  Bottom 0.508: U$2.1 90.17,30.52 88.94,31.75 v88.9,31.75
N$9
  Bottom 0.254: C9.1 13.34,3.59 U1.21
N$10
  Bottom 0.305: U1.24 16.29,4.88 C15.1
N$13
  Bottom 0.508: Q6.1 92.97,24.55 R6.2 94.4,23.7 R13.1
N$14  (via drill 0.35)
  Top 0.508: R12.1 96.54,24.45 94.95,22.86 v90.17,22.86
  Bottom 0.508: Q6.2 90.49,23.18 v90.17,22.86
N$15  (via drill 0.35)
  Top 0.406: U$1.5 82.04,27.99 83.7,26.33 83.7,16.63 v86.36,13.97
  Bottom 0.406: R19.1 90.29,9.31 BT1.+ 89.65,11.33 C5.1 C8.1 87.21,13.12 v86.36,13.97
N$16
  Bottom 0.406: D2.3 94.66,11.01 R19.2
N$17  (via drill 0.35)
  Top 0.406: v50.8,11.43 55.88,6.35 LED2.A
  Bottom 0.406: R4.1 v50.8,11.43
N$18  (via drill 0.35)
  Top 0.406: v54.61,11.43 59.91,6.13 LED3.A
  Bottom 0.406: R16.1 v54.61,11.43
N$19  (via drill 0.35)
  Top 0.406: v45.72,44.03 v45.72,40.64
  Bottom 0.406: R10.2 v45.72,44.03 | v45.72,40.64 45.4,40.32 Q2.B
N$20  (via drill 0.35)
  Top 0.406: v48.26,40.64 46.99,41.91 v46.99,45.61
  Bottom 0.406: R21.2 v48.26,40.64 | v46.99,45.61 45.61,45.61 44.13,44.13 Q5.B
N$21  (via drill 0.35)
  Top 0.406: v58.42,11.43 62.76,7.08 64.25,7.08 65.2,6.13 LED4.A
  Bottom 0.406: R17.1 v58.42,11.43
N$22  (via drill 0.35)
  Top 0.406: LED5.A 72.82,6.13 71.87,7.08 66.57,7.08 v62.23,11.43
  Bottom 0.406: R18.1 v62.23,11.43
N$24
  Bottom 0.508: R25.1 80.37,33.44 80.31,33.38 75.35,33.38 Q8.1
PGM  (via drill 0.35)
  Top 0.406: v16.51,29.21 20.5,25.22 U2.25
  Bottom 0.406: Q5.C 39.1,44.89 27.24,44.89 16.51,34.15 v16.51,29.21
PROBE  (via drill 0.35)
  Top 0.406: U2.9 48.08,18.87 v48.26,19.05 | v88.9,17.78 88.9,19.05 86.36,21.59 86.36,24.13 88.9,26.67 v92.71,26.67
  Bottom 0.406: v48.26,19.05 77.47,19.05 78.74,17.78 v88.9,17.78 | v92.71,26.67 94.83,26.67 R6.1
  Bottom 0.508: U$2.2 91.98,31.22 92.46,31.22 92.98,30.7 92.98,28.05 93.22,27.81 93.69,27.81 R6.1
RTS
  Bottom 0.406: Q2.E 47.09,38.42 R21.1 53.06,37.25 U3.19
RX0  (via drill 0.35)
  Top 0.406: U2.34 28.4,13.79 28.83,13.35 34.94,13.35 v35.56,13.97 | v39.37,31.75 47.53,39.91 48.56,39.91 49.3,40.64 v50.8,40.64
  Bottom 0.254: U3.21 52.32,39.12 v50.8,40.64
  Bottom 0.406: v35.56,13.97 36.83,15.24 36.83,29.21 v39.37,31.75
RX1  (via drill 0.35)
  Top 0.406: U$1.2 73.89,12.7 62.79,12.7 62.77,12.72 50.27,12.72 50.24,12.7 44.92,12.7 36.61,4.38 21.25,4.38 17.12,8.51 17.12,14.92 17.78,15.57 v17.78,17.78 | v15.24,19.05 18.87,22.68 U2.27
  Bottom 0.406: v17.78,17.78 16.51,19.05 v15.24,19.05
RX2  (via drill 0.35)
  Top 0.406: U2.26 21.52,23.48 18.64,23.48 14.51,19.35 14.51,18.74 15.39,17.86 15.39,7.16 19.48,3.07 80.23,3.07 82.01,4.85 82.01,5.81 v82.55,6.35
  Bottom 0.305: v82.55,6.35 82.55,7.31 81.56,8.3 75.92,8.3 74.02,6.41 72.45,6.41
  Bottom 0.406: 72.45,6.41 U$7.3
RX3  (via drill 0.35)
  Top 0.406: U2.11 43.91,21.41 v45.72,19.6 | v50.8,8.89 54.61,5.08 v76.2,5.08
  Bottom 0.406: v45.72,19.6 49.89,15.43 49.89,11.3 50.8,10.39 v50.8,8.89 | v76.2,5.08 77.53,6.41 U$8.3
SCL  (via drill 0.35)
  Top 0.406: v22.86,5.12 22.36,5.61 21.29,5.61 19.28,7.62 v19.05,7.62 19.05,12.13 19.73,12.81 19.81,12.81 20.62,13.63 20.62,14.39 20.83,14.6 21.52,14.6 U2.33
  Bottom 0.203: U1.2 18.41,6.97 v19.05,7.62
  Bottom 0.406: U$11.2 U$3.2 U$4.2 U$9.2 U$10.2 U$5.2 v22.86,5.12
  Bottom 0.508: R22.1 67.73,11.06 68.66,10.14 68.66,6.42 67.31,5.08 63.54,5.08 U$11.2
SDA  (via drill 0.35)
  Top 0.406: v21.59,6.35 21.59,7.15 20.62,8.11 20.62,10.58 20.83,10.79 21.52,10.79 U2.36
  Bottom 0.203: U1.4 19.3,5.31 19.3,5.64 20.01,6.35 v21.59,6.35
  Bottom 0.406: U$11.3 U$3.3 U$4.3 U$9.3 U$10.3 U$5.3 21.61,6.37 v21.59,6.35
  Bottom 0.508: R15.1 65.04,11.28 65.04,8.8 66.04,7.8 66.04,7.62 64.79,6.37 U$11.3
TX0  (via drill 0.35)
  Top 0.406: U2.35 36.65,12.52 v36.83,12.7 | v40.64,30.48 48.78,38.62 v50.8,38.62
  Bottom 0.254: U3.20 v50.8,38.62
  Bottom 0.406: v36.83,12.7 36.83,14.45 37.39,15.01 37.39,27.23 v40.64,30.48
TX1
  Top 0.406: U$1.1 75.16,11.43 63.27,11.43 62.53,12.16 50.5,12.16 49.76,11.43 44.44,11.43 36.84,3.83 19.51,3.83 15.95,7.39 15.95,17.33 19.56,20.95 21.52,20.95 U2.28
TX2  (via drill 0.35)
  Top 0.406: U2.24 v24.77,24.13 | v13.97,12.16 14.83,12.16 14.83,6.92 19.24,2.52 80.46,2.52 82.57,4.62 82.57,5.33 85.82,8.59 85.82,10.46 85.39,10.89 82.25,10.89 78.97,7.62 v76.2,7.62
  Bottom 0.406: U$7.2 73.74,5.16 v76.2,7.62 | v24.77,24.13 20.42,19.78 14.94,19.78 12.26,17.11 12.26,13.27 13.37,12.16 v13.97,12.16
TX3  (via drill 0.35)
  Top 0.406: U2.10 38.52,20.6 37.83,20.6 35.04,23.39 24.46,23.39 23.96,23.9 23.96,25.57 v22.86,26.67 | v8.89,16.51 8.89,15.88 7.92,14.92 7.92,5.38 v7.62,5.08 | v10.16,5.08 15.89,5.08 19.01,1.96 80.7,1.96 83.13,4.39 83.13,4.47 v83.82,5.16
  Bottom 0.406: U$8.2 v83.82,5.16 | v22.86,26.67 16.53,20.34 12.17,20.34 8.89,17.07 v8.89,16.51 | v7.62,5.08 v10.16,5.08
V_BATT
  Bottom 0.406: 77.47,42.43 76.87,42.43 U5.3
  Bottom 0.508: 80.22,42.12 C11.1 77.57,42.43 77.47,42.43 U5.4 | Q4.3 79.12,42.12 80.22,42.12 | 80.22,42.12 82.81,39.53 84.51,39.53 R23.2 89.75,36.83 93.98,36.83 93.98,40.26 LBAT.1
VCC  (via drill 0.35)
  Top 0.406: v73.66,45.61 72.39,44.34 72.39,41.77 | 66.04,40.89 LED1.A 65.82,39.37 v59.69,39.37
  Top 0.508: J1.1 64.85,41.77 65.73,40.89 66.04,40.89 67.67,40.89 68.55,41.77 72.39,41.77 78.88,41.77 v81.28,39.37 81.28,38.47 D3.C
  Bottom 0.254: U5.1 U5.2
  Bottom 0.305: U3.8 58.94,40.12 v59.69,39.37
  Bottom 0.406: U5.1 74.69,45.61 v73.66,45.61
  Bottom 0.508: v81.28,39.37 79.86,39.37 Q4.1 79.84,39.39 D1.1 81.48,37.78 R1.2 81.7,35.99 R25.2
VCC_SENSE  (via drill 0.35)
  Top 0.406: U2.7 44.27,16.33 v44.45,16.51
  Bottom 0.406: v44.45,16.51 44.99,17.04 44.99,20.62 45.95,21.59 69.85,21.59 74.76,26.5 Q8.2
  Bottom 0.508: R9.2 84.18,33.44 83.27,32.53 75.22,32.53 Q8.2
VCCIO  (via drill 0.35)
  Top 0.406: U2.2 29.03,9.98 v27.94,8.89 | v40.64,36.83 40.64,43.18 38.93,44.89 34.29,44.89 | 34.29,44.89 24.61,44.89 24.51,44.98 22.13,44.98 20.32,43.18 20.32,33.02 v21.59,31.75 | 34.29,44.89 v34.29,43.18 | v31.75,39.37 31.75,41.51 J3.4
  Top 0.508: v69.85,39.37 75.54,33.68 84.27,33.68 88.13,29.82 91.69,29.82 93.64,27.87 v96.59,27.87 96.59,26.32 R12.2 | v60.96,33.02 59.69,34.29 R5.2 | v10.16,10.16 10.16,13.18 S2.2
  Bottom 0.305: U3.5 U3.6 U3.7 60.56,40.62
  Bottom 0.406: C6.1 60.56,40.62 | 62.23,38.88 C6.1 | C6.1 59.67,36.39 47.56,36.39 47.13,36.83 v40.64,36.83 35.56,31.75 35.56,16.51 32.31,13.26 32.31,11.2 30.71,9.6 28.65,9.6 v27.94,8.89 | R20.1 v21.59,31.75 | v34.29,43.18 31.75,40.64 v31.75,39.37 | 66.99,34.23 Q7.2 | C6.1 62.23,38.99
  Bottom 0.508: U4.5 71.12,38.96 | 71.12,38.96 C4.1 C2.1 66.99,34.82 Q7.2 | 59.67,36.39 59.79,36.39 62.06,34.12 | 62.06,34.12 65.37,30.81 68.75,30.81 70.96,33.02 Q8.3 | 96.35,22.61 R13.2 96.1,23.64 96.59,24.13 v96.59,27.87 | 71.12,38.96 70.26,38.96 v69.85,39.37 | 62.06,34.12 v60.96,33.02 | v27.94,8.89 19.68,8.89 19.61,8.96 13.9,8.96 12.7,10.16 v10.16,10.16 | 62.23,38.99 66.99,34.23
WATER  (via drill 0.35)
  Top 0.406: U2.4 39.16,12.7 44.13,12.7 44.69,13.26 50.01,13.26 50.03,13.28 63,13.28 63.02,13.26 72.95,13.26 78.74,19.05 v78.74,21.59
  Bottom 0.406: v78.74,21.59 84.24,27.09 R14.2
  Bottom 0.508: Q6.3 90.34,25.22 R14.2

### Text on the board
tPlace: Charge | Open Source Ocean Data Logger / project-hermes.com | GPS | Error | Sync | Wifi | Diving
bPlace: MicroSD card / for data logging | rev. D / 8/2019 | BATT | Charge + / Water Detect | Serial | I2C | IMU | Serial2 | Serial3
tStop: Reset | Config